# EAGLE design i2-hub (EAGLE 6.1)
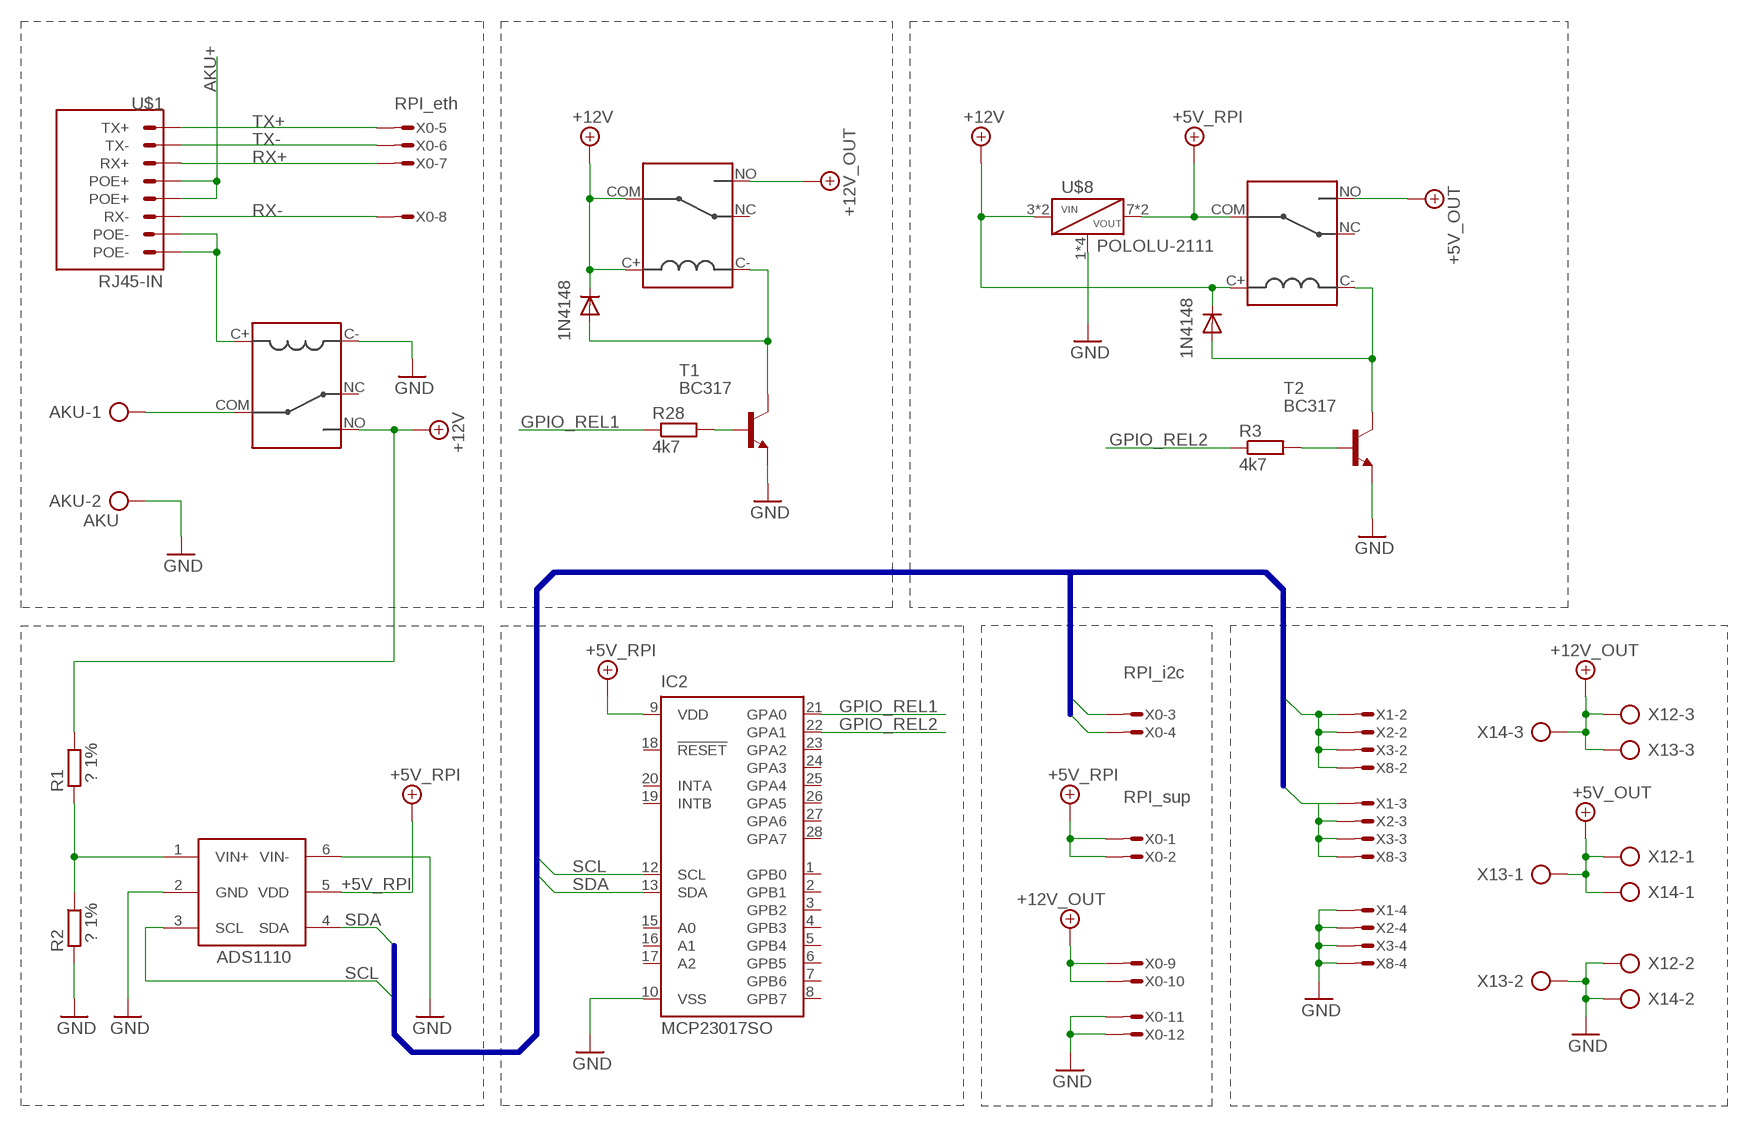
[diagram p0: schematic, sheet 1]

## Parts
AKU  AKU  AK500/2  [AK500/2]
IC1  ADS1110  [SOT-23-6]
IC2  MCP23017SO  [SO28W]
R1  ? 1%  R-EU_R0603  [R0603]
R2  ? 1%  R-EU_R0603  [R0603]
R3  4k7  R-EU_R0603  [R0603]
R28  4k7  R-EU_R0603  [R0603]
T1  BC317  -NPN-SOT23-EBC  [SOT23-EBC]
T2  BC317  -NPN-SOT23-EBC  [SOT23-EBC]
U$1  RJ45-IN  RJ45  [8P8C-TOP]
U$3  1N4148  D0603  [D0603]
U$4  1N4148  D0603  [D0603]
U$5  FBR51  [PC_RELAY]
U$6  FBR51  [PC_RELAY]
U$7  FBR51  [PC_RELAY]
U$8  POLOLU-2111  [POLOLU-2111]
X0  MICROMATCH-12  [MICROMATCH-12]
X1  MICROMATCH-4  [MICROMATCH-4]
X2  MICROMATCH-4  [MICROMATCH-4]
X3  MICROMATCH-4  [MICROMATCH-4]
X8  MICROMATCH-4  [MICROMATCH-4]
X12  AK500/3-H  [AK500/3-H]
X13  AK500/3-H  [AK500/3-H]
X14  AK500/3-H  [AK500/3-H]

## Nets
+5V: U$5.NO X12.1 X13.1 X14.1 ; supply symbol labelled +5V_OUT
+5V/1: IC2.9(VDD) ; supply symbol labelled +5V_RPI
+5V_RPI: IC1.5(VDD) U$5.COM U$8.7(VOUT) U$8.8(VOUT) X0.1 X0.2
+12V: R1.1 U$3.2(C) U$4.2(C) U$5.C+ U$6.NO U$7.C+ U$7.COM U$8.3(VIN) U$8.4(VIN) X0.9 X0.10 X12.3 X13.3 X14.3 ; supply symbol labelled +12V_OUT
+12V_OUT: U$7.NO
AKU+: AKU.1 U$1.4(POE+) U$1.5(POE+) U$6.COM
GND: AKU.2 IC1.2(GND) IC1.6(VIN-) IC2.10(VSS) R2.2 T1.E T2.E U$6.C- U$8.1(GND) U$8.2(GND) U$8.5(GND) U$8.6(GND) X0.11 X0.12 X1.4 X2.4 X3.4 X8.4 X12.2 X13.2 X14.2
GPIO_REL1: IC2.21(GPA0) R28.1
GPIO_REL2: IC2.22(GPA1) R3.1
N$1: R3.2 T2.B
N$2: T2.C U$3.1(A) U$5.C-
N$33: T1.C U$4.1(A) U$7.C-
N$41: R28.2 T1.B
POE-: U$1.7(POE-) U$1.8(POE-) U$6.C+
RX+: U$1.1(RX+) X0.7
RX-: U$1.2(RX-) X0.8
SCL: IC1.3(SCL) IC2.12(SCL) X0.4 X1.3 X2.3 X3.3 X8.3
SDA: IC1.4(SDA) IC2.13(SDA) X0.3 X1.2 X2.2 X3.2 X8.2
TX+: U$1.3(TX+) X0.5
TX-: U$1.6(TX-) X0.6
V_SENS: IC1.1(VIN+) R1.2 R2.1
Unconnected: IC2.1(GPB0) IC2.2(GPB1) IC2.3(GPB2) IC2.4(GPB3) IC2.5(GPB4) IC2.6(GPB5) IC2.7(GPB6) IC2.8(GPB7) IC2.15(A0) IC2.16(A1) IC2.17(A2) IC2.18(!RESET) IC2.19(INTB) IC2.20(INTA) IC2.23(GPA2) IC2.24(GPA3) IC2.25(GPA4) IC2.26(GPA5) IC2.27(GPA6) IC2.28(GPA7) U$5.NC U$6.NC U$7.NC X1.1 X2.1 X3.1 X8.1

## Buses
SDA,SCL

## Notes on the sheet
- RPI_eth
- RPI_i2c
- RPI_sup

## Library data of the parts
AKU = con-ptr500:AK500/2: CONNECTOR; OC_FARNELL: unknown; OC_NEWARK: unknown
IC1 = ads11xx:ADS1110: Analog/Digital conventer i2c Bus max: 2.048v
IC2 = adafruit:MCP23017: http://ww1.microchip.com/downloads/en/DeviceDoc/21952a.pdf Source: http://ww1.microchip.com/downloads/en/DeviceDoc/21952a.pdf
R1-R3 R28 = rcl:R-EU_: RESISTOR, European symbol
T1 T2 = transistor:*-NPN-: NPN Transistror BF959 corrected 2008.03.06
U$1 = con-maritex:RJ45
U$3 U$4 = wojtkowa:D0603
U$5-U$7 = wb:FBR51
U$8 = pololu:POLOLU-2111: Pololu item #: 2111
X0 = con-maritex:MICROMATCH-12: MicroMaTch 12 8-215464-2 / 1-215464-2 Drawing Number C-215464 DDEController.pdf
X1-X3 X8 = con-maritex:MICROMATCH-4: MicroMaTch 4 7-215464-4 / 0-215464-4 Drawing Number C-215464 DDEController.pdf
X12-X14 = con-ptr500:AK500/3-H: CONNECTOR Aug. 2004 / PTR Meßtechnik: Die Bezeichnung der Serie AK505 wurde geändert. Es handelt sich hierbei um AK500 in horizontaler Ausführung.; OC_FARNELL: unknown; OC_NEWARK: unknown

## Board
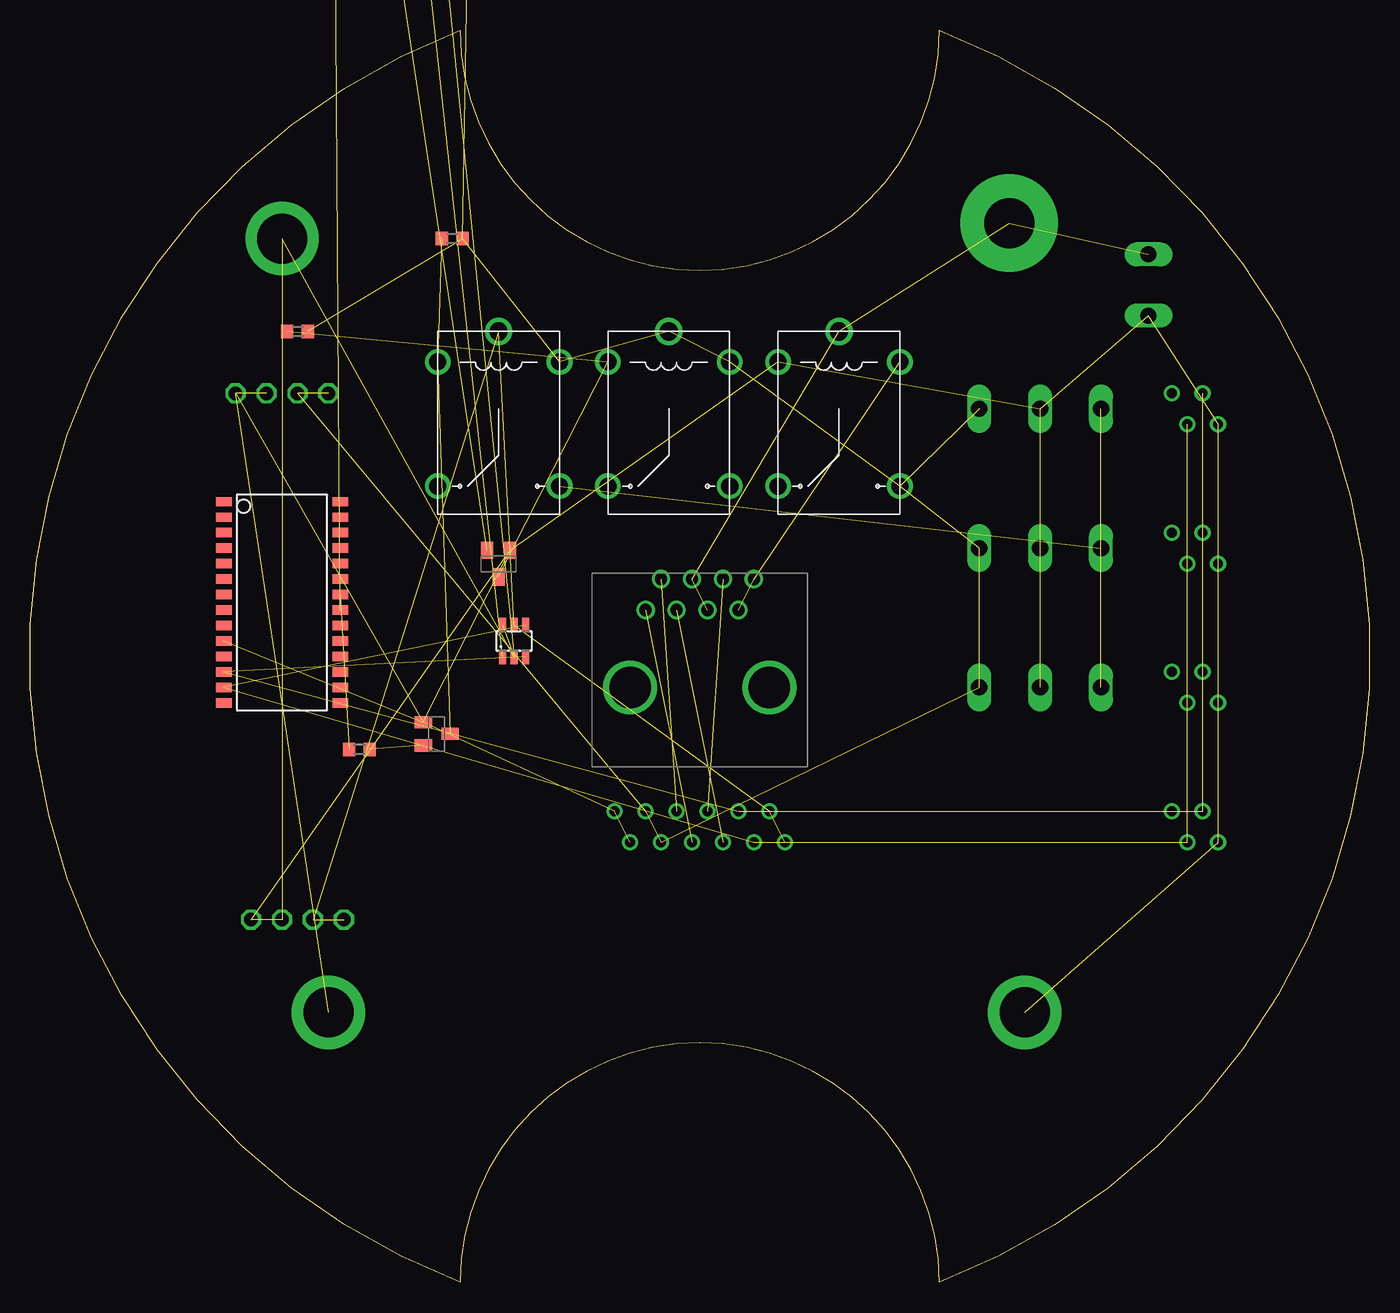
[diagram p1: board, top side]
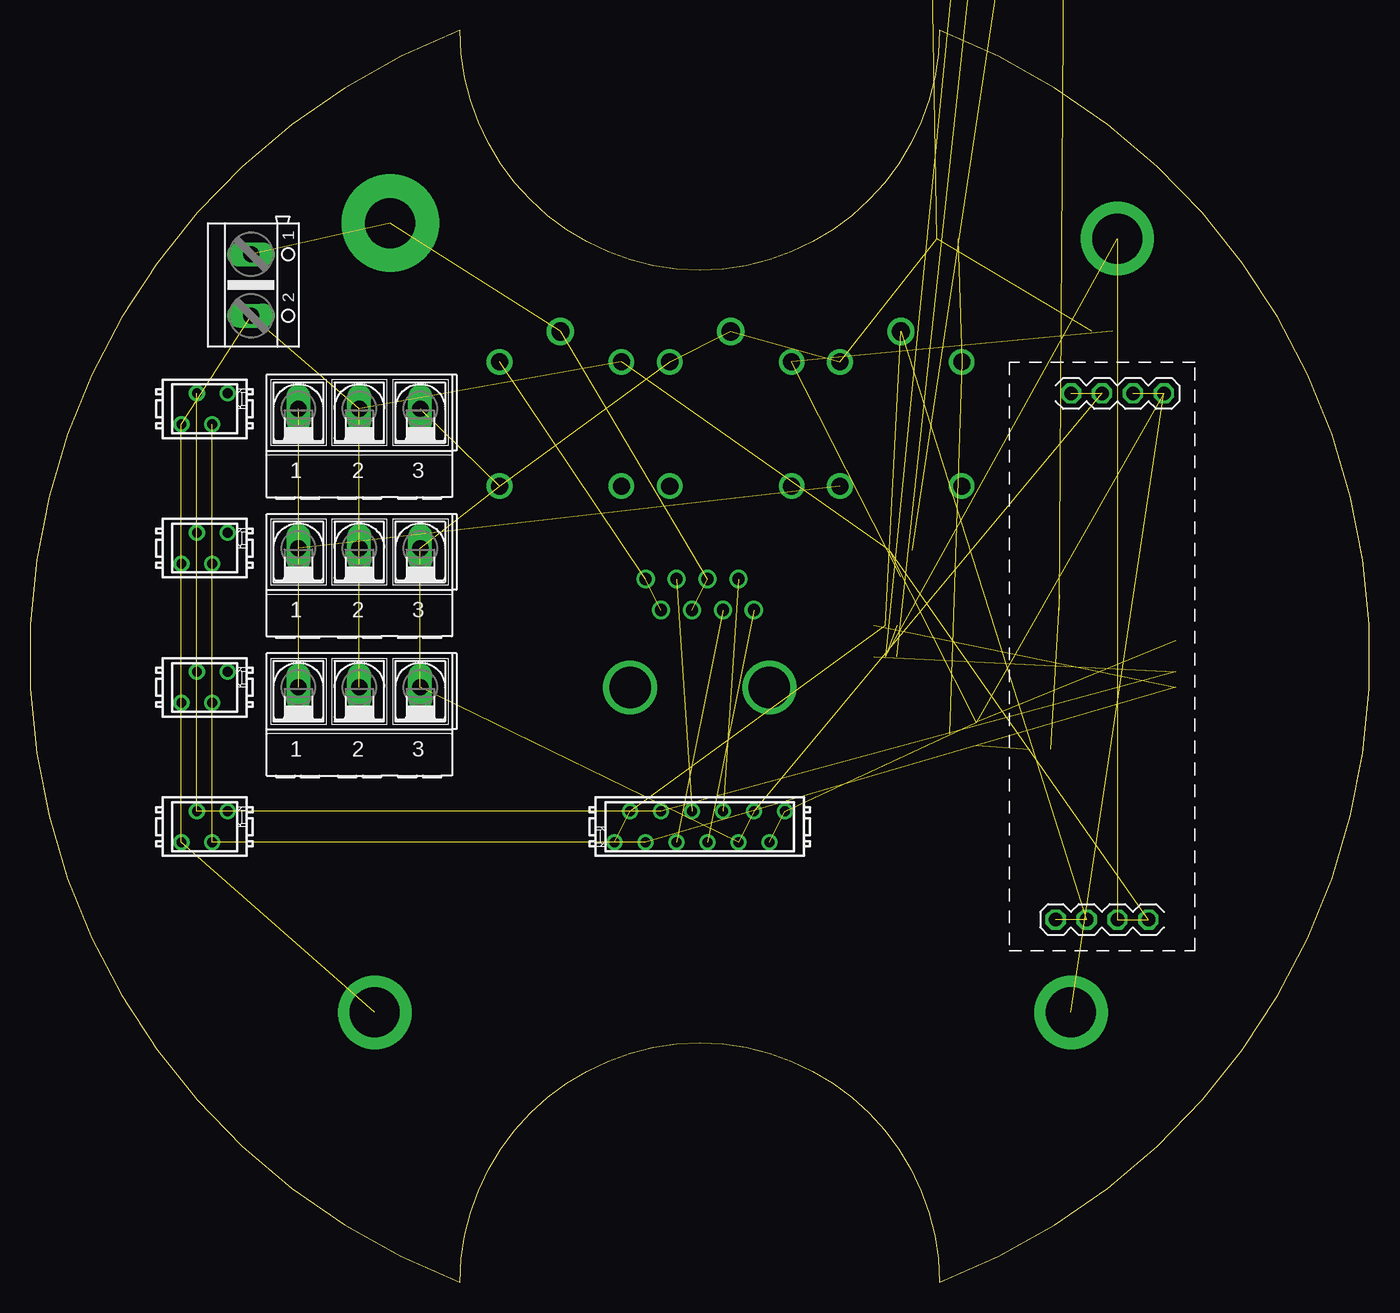
[diagram p2: board, bottom side, seen from below]

Size 109.87 x 102.73 mm. Coordinates in mm from the lower left corner, seen from the top.
Outline: 35.27,102.73 arc180 74.6,102.73 arc-138 74.6,0 arc180 35.27,0 arc-138 35.27,102.73
Copper layers (1*16): Top 0.035mm / dielectric 1.5mm / Bottom 0.035mm
Design rules: minimum track width 10mil, minimum drill 24mil, track to track 8mil, track to pad 8mil, pad to pad 8mil, via to via 8mil, smd to smd 8mil, copper to edge 40mil, drill to drill 8mil, minimum pad ring 10mil, minimum via ring 8mil, stop-mask expansion 4mil, vias tented up to drill 0mil, thermal gap 10mil

### Footprints (pad centres in the part's own frame; a part is rotated, then mirrored left to right if it is on the bottom)
AK500/2 = drill 1.321 long: 1 -2.515,0; 2 2.515,0
SOT-23-6 = smd 0.55 x 1.2: 1 -0.95,-1.3; 2 0,-1.3; 3 0.95,-1.3; 4 0.95,1.3; 5 0,1.3; 6 -0.95,1.3
SO28W = smd 0.762 x 1.27: 1 -7.62,-4.78; 2 -6.35,-4.78; 3 -5.08,-4.78; 4 -3.81,-4.78; 5 -2.54,-4.78; 6 -1.27,-4.78; 7 0,-4.78; 8 1.27,-4.78; 9 2.54,-4.78; 10 3.81,-4.78; 11 5.08,-4.78; 12 6.35,-4.78; 13 7.62,-4.78; 14 8.89,-4.78; 15 8.89,4.78; 16 7.62,4.78; 17 6.35,4.78; 18 5.08,4.78; 19 3.81,4.78; 20 2.54,4.78; 21 1.27,4.78; 22 0,4.78; 23 -1.27,4.78; 24 -2.54,4.78; 25 -3.81,4.78; 26 -5.08,4.78; 27 -6.35,4.78; 28 -7.62,4.78
R0603 = smd 1 x 1.1: 1 -0.85,0; 2 0.85,0
SOT23-EBC = smd 1 x 1.4: B 0.95,-1.1; C 0,1.1; E -0.95,-1.1
8P8C-TOP = drill 1: 1 -3.81,-4.445; 2 -6.35,-3.175; 3 -3.81,-1.905; 4 -6.35,-0.635; 5 -3.81,0.635; 6 -6.35,1.905; 7 -3.81,3.175; 8 -6.35,4.445 | drill 3.4: 9 2.54,5.715; 10 2.54,-5.715
D0603 = smd 1 x 1.1: 1 -0.85,0; 2 0.85,0
PC_RELAY = drill 1.4: C+ 2.5,5; C- 2.5,-5; NC 12.7,-5; NO 12.7,5 | drill 1.5: COM 0,0
POLOLU-2111 = drill 1.1 octagon: 1 2.54,12.7; 2 2.54,10.16; 3 2.54,7.62; 4 2.54,5.08; 5 45.72,11.43; 6 45.72,8.89; 7 45.72,6.35; 8 45.72,3.81
MICROMATCH-12 = drill 0.813: 1 6.985,1.27; 2 5.715,-1.27; 3 4.445,1.27; 4 3.175,-1.27; 5 1.905,1.27; 6 0.635,-1.27; 7 -0.635,1.27; 8 -1.905,-1.27; 9 -3.175,1.27; 10 -4.445,-1.27; 11 -5.715,1.27; 12 -6.985,-1.27
MICROMATCH-4 = drill 0.813: 1 1.905,1.27; 2 0.635,-1.27; 3 -0.635,1.27; 4 -1.905,-1.27
AK500/3-H = drill 1.321 long: 1 -5.004,0; 2 0,0; 3 5.004,0

### Placement (x,y rotation side)
AKU  91.77,81.84 270 bottom
IC1  39.7,52.63 0 top
IC2  20.65,56.44 270 top
R1  37.16,132.64 0 top  (outside the outline)
R2  30.81,132.64 0 top  (outside the outline)
R3  27,43.74 0 top
R28  25.73,132.64 0 top  (outside the outline)
T1  38.43,58.98 180 top
T2  33.35,45.01 270 top
U$1  54.94,51.36 270 top
U$3  34.62,85.65 0 top
U$4  21.92,78.03 0 top
U$5  38.43,78.03 270 top
U$6  66.37,78.03 270 top
U$7  52.4,78.03 270 top
U$8  29.54,75.49 270 bottom
X0  54.94,37.39 180 bottom
X1  95.58,71.68 0 bottom
X2  95.58,60.25 0 bottom
X3  95.58,48.82 0 bottom
X8  95.58,37.39 0 bottom
X12  82.88,71.68 0 bottom
X13  82.88,60.25 0 bottom
X14  82.88,48.82 0 bottom

### Tracks (layer width: path | path; a pad name or v marks a point on that pad's centre or on a via)
+5V  (3 unrouted)
+5V_RPI  (5 unrouted)
+12V  (13 unrouted)
AKU+  (via drill 4.1 pad 8)  (4 unrouted)
  other vias: 80.34,86.92
GND  (via drill 4.1 pad 6)  (23 unrouted)
  other vias: 81.61,22.15 24.46,22.15 20.65,85.65
GPIO_REL1  (1 unrouted)
GPIO_REL2  (1 unrouted)
N$1  (1 unrouted)
N$2  (2 unrouted)
N$33  (2 unrouted)
N$41  (1 unrouted)
POE-  (2 unrouted)
RX+  (1 unrouted)
RX-  (1 unrouted)
SCL  (6 unrouted)
SDA  (6 unrouted)
TX+  (1 unrouted)
TX-  (1 unrouted)
V_SENS  (2 unrouted)